# Altium schematic sheet Manual_Switch.SchDoc
size 101 x 76 mm; SheetNumber: 5; SheetTotal: 5
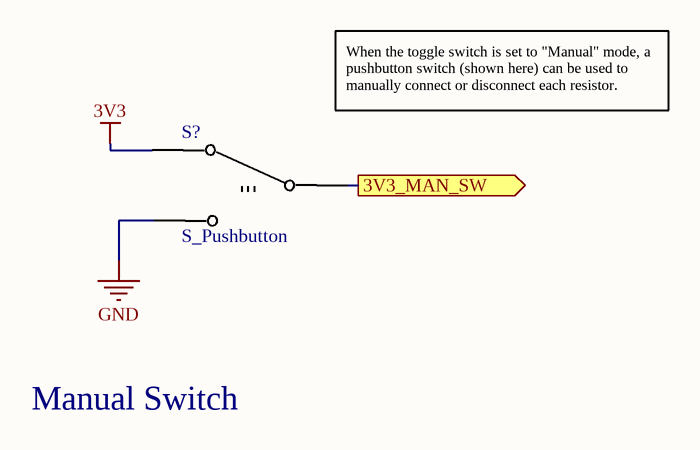
[diagram p0: Manual_Switch.SchDoc]

## Parts
S?  S_Pushbutton  [PUSHBUTTON]

## Ports
3V3_MAN_SW (out)

## Nets
3V3: S?.1
GND: S?.3
3V3_MAN_SW: S?.2 ; port 3V3_MAN_SW

Not connected (* = marked no-connect by the designer): S? 4 5 6

## Notes on the sheet
- (near S?) When the toggle switch is set to "Manual" mode, a pushbutton switch (shown here) can be used to manually connect or disconnect each resistor.
- Manual Switch

## Library data of the parts
S? = S_Pushbutton: Switch Pushbutton